# EAGLE schematic compressor_ngspice (EAGLE 9.6.2)
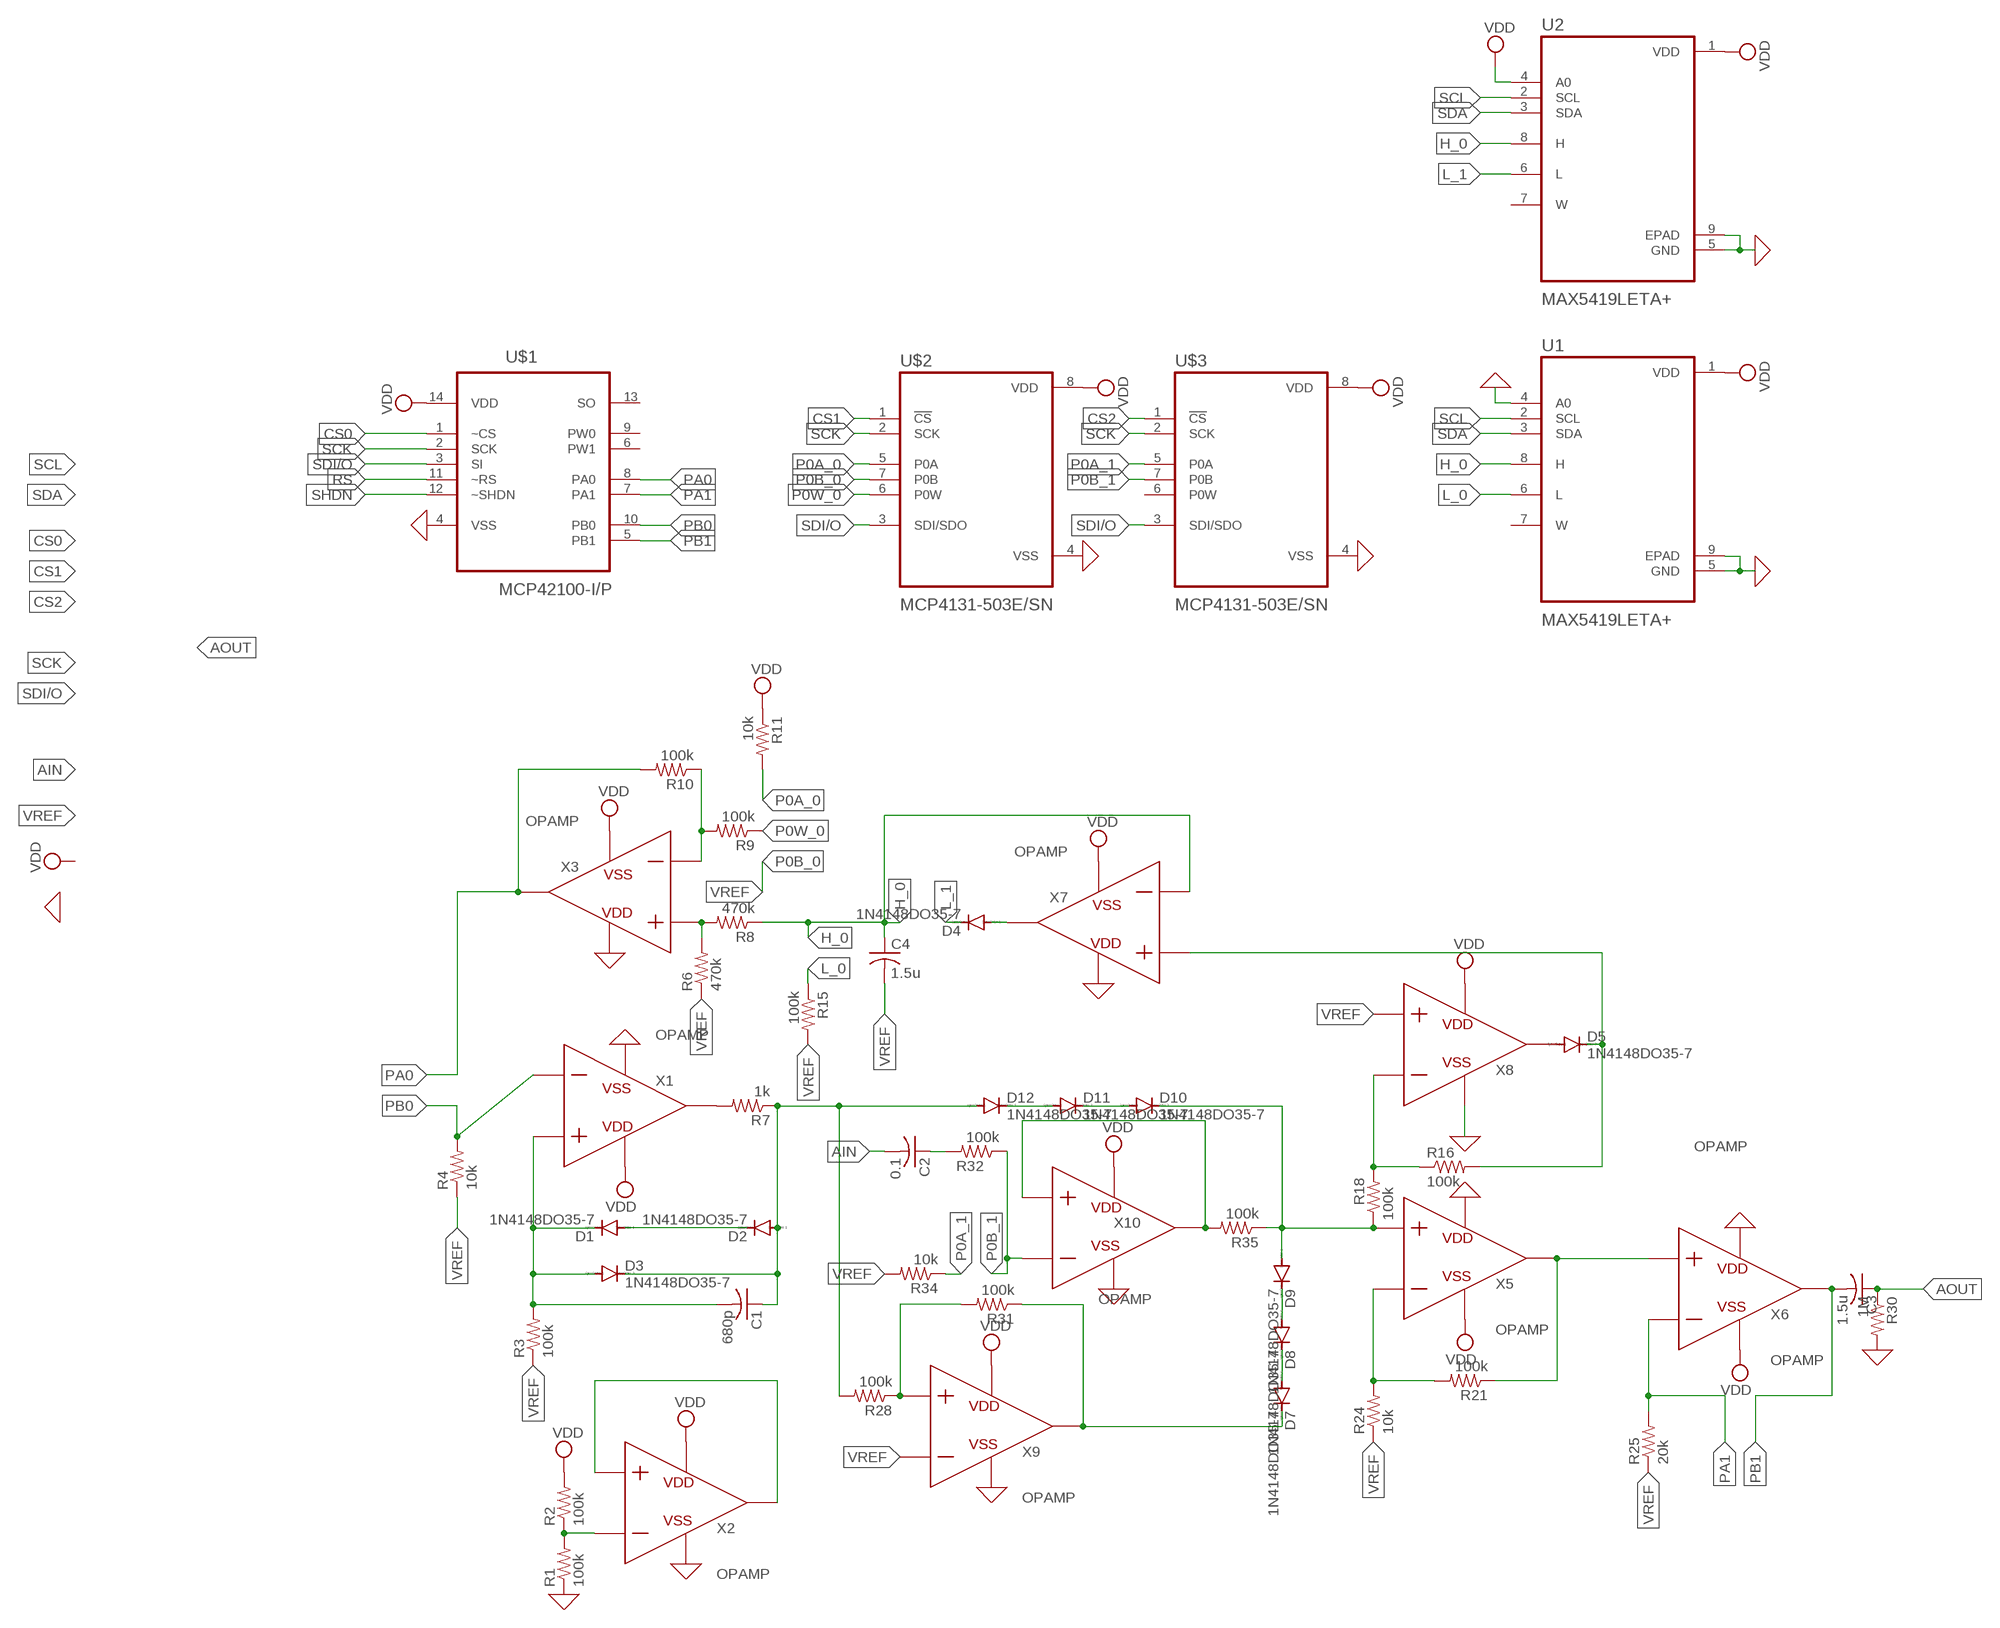
[diagram p0: schematic, sheet 1]

## Parts
C1  680p  C-US025-024X044  [C025-024X044]
C2  0.1  C-US025-024X044  [C025-024X044]
C3  1.5u  C-US025-024X044  [C025-024X044]
C4  1.5u  C-US025-024X044  [C025-024X044]
D1  1N4148DO35-7  [DO35-7]
D2  1N4148DO35-7  [DO35-7]
D3  1N4148DO35-7  [DO35-7]
D4  1N4148DO35-7  [DO35-7]
D5  1N4148DO35-7  [DO35-7]
D7  1N4148DO35-7  [DO35-7]
D8  1N4148DO35-7  [DO35-7]
D9  1N4148DO35-7  [DO35-7]
D10  1N4148DO35-7  [DO35-7]
D11  1N4148DO35-7  [DO35-7]
D12  1N4148DO35-7  [DO35-7]
R1  100k  R-US_0204/7  [0204/7]
R2  100k  R-US_0204/7  [0204/7]
R3  100k  R-US_0204/7  [0204/7]
R4  10k  R-US_0204/7  [0204/7]
R6  470k  R-US_0204/7  [0204/7]
R7  1k  R-US_0204/7  [0204/7]
R8  470k  R-US_0204/7  [0204/7]
R9  100k  R-US_0204/7  [0204/7]
R10  100k  R-US_0204/7  [0204/7]
R11  10k  R-US_0204/7  [0204/7]
R15  100k  R-US_0204/7  [0204/7]
R16  100k  R-US_0204/7  [0204/7]
R18  100k  R-US_0204/7  [0204/7]
R21  100k  R-US_0204/7  [0204/7]
R24  10k  R-US_0204/7  [0204/7]
R25  20k  R-US_0204/7  [0204/7]
R28  100k  R-US_0204/7  [0204/7]
R30  1M  R-US_0204/7  [0204/7]
R31  100k  R-US_0204/7  [0204/7]
R32  100k  R-US_0204/7  [0204/7]
R34  10k  R-US_0204/7  [0204/7]
R35  100k  R-US_0204/7  [0204/7]
U1  MAX5419LETA+  [SON65P300X300X80-9N]
U2  MAX5419LETA+  [SON65P300X300X80-9N]
U$1  MCP42100-I/P  [DIP254P762X432-14]
U$2  MCP4131-503E/SN  [SOIC127P599X175-8N]
U$3  MCP4131-503E/SN  [SOIC127P599X175-8N]
X1  OPAMP  (no package)
X2  OPAMP  (no package)
X3  OPAMP  (no package)
X5  OPAMP  (no package)
X6  OPAMP  (no package)
X7  OPAMP  (no package)
X8  OPAMP  (no package)
X9  OPAMP  (no package)
X10  OPAMP  (no package)

## Nets
0: R1.1 R30.2 U1.4(A0) U1.5(GND) U1.9(EPAD) U2.5(GND) U2.9(EPAD) U$1.4(VSS) U$2.4(VSS) U$3.4(VSS) X1.VSS X2.VSS X3.VDD X5.VDD X6.VDD X7.VDD X8.VSS X9.VSS X10.VSS ; supply symbol labelled GND
AIN: C2.2
AOUT: C3.1 R30.1
CS0: U$1.1(~CS)
CS1: U$2.1(!CS)
CS2: U$3.1(!CS)
H_0: C4.1 R8.1 U1.8(H) U2.8(H) X7.N
L_0: R15.1 U1.6(L)
L_1: D4.C U2.6(L)
N$1: R7.2 X1.VOUT
N$3: C1.2 D1.C D3.A R3.2 X1.P
N$4: R1.2 R2.1 X2.N
N$5: X2.P X2.VOUT
N$6: R6.2 R8.2 X3.P
N$7: R9.2 R10.1 X3.N
N$10: R11.2
N$11: C4.2
N$14: D4.A X7.VOUT
N$15: D5.C R16.2 X7.P
N$16: R16.1 R18.2 X8.N
N$18: R21.1 X5.VOUT X6.P
N$19: R21.2 R24.2 X5.N
N$20: D1.A D2.C
N$21: C1.1 D2.A D3.C D12.A R7.1 R28.2
N$22: R28.1 R31.2 X9.P
N$23: D7.C R31.1 X9.VOUT
N$24: D8.A D9.C
N$25: D7.A D8.C
N$26: D9.A D10.C R18.1 R35.1 X5.P
N$27: R35.2 X10.P X10.VOUT
N$30: C2.1 R32.2
N$31: D11.A D12.C
N$32: D10.A D11.C
N$33: D5.A X8.VOUT
P0A_0: U$2.5(P0A)
P0A_1: R34.1 U$3.5(P0A)
P0B_0: U$2.7(P0B)
P0B_1: R32.1 U$3.7(P0B) X10.N
P0W_0: U$2.6(P0W)
PA0: R10.2 U$1.8(PA0) X3.VOUT
PA1: R25.2 U$1.7(PA1) X6.N
PB0: R4.2 U$1.10(PB0) X1.N
PB1: C3.2 U$1.5(PB1) X6.VOUT
RS: U$1.11(~RS)
SCK: U$1.2(SCK) U$2.2(SCK) U$3.2(SCK)
SCL: U1.2(SCL) U2.2(SCL)
SDA: U1.3(SDA) U2.3(SDA)
SDI/O: U$1.3(SI) U$2.3(SDI/SDO) U$3.3(SDI/SDO)
SHDN: U$1.12(~SHDN)
VDD: R2.2 R11.1 U1.1(VDD) U2.1(VDD) U2.4(A0) U$1.14(VDD) U$2.8(VDD) U$3.8(VDD) X1.VDD X2.VDD X3.VSS X5.VSS X6.VSS X7.VSS X8.VDD X9.VDD X10.VDD
VREF: R4.1
Unconnected: R3.1 R6.1 R9.1 R15.2 R24.1 R25.1 R34.2 U1.7(W) U2.7(W) U$1.6(PW1) U$1.9(PW0) U$1.13(SO) U$3.6(P0W) X8.P X9.N

## Library data of the parts
C1-C4 = rcl:C-US: CAPACITOR, American symbol; SPICEPREFIX: C
D1-D5 D7-D12 = diode:1N4148: DIODE high speed (Philips)
R1-R4 R6-R11 R15 R16 R18 R21 R24 R25 R28 R30-R32 R34 R35 = rcl:R-US_: RESISTOR, American symbol; SPICEPREFIX: R
U1 U2 = MAX5419LETA_:MAX5419LETA+: Check availability <https://pricing.snapeda.com/parts/MAX5419LETA%2B/Analog%20Devices/view-part?ref=eda>; AVAILABILITY: In Stock; CHECK_PRICES: https://www.snapeda.com/parts/MAX5419LETA+/Analog+Devices/view-part/?ref=eda; DESCRIPTION: 256-Tap, Nonvolatile, I²C-Interface, Digital Potentiometers; MF: Analog Devices; MP: MAX5419LETA+; PACKAGE: TDFN-EP-8 Maxim; PRICE: None; PURCHASE-URL: https://www.snapeda.com/api/url_track_click_mouser/?unipart_id=895758&manufacturer=Analog Devices&part_name=MAX5419LETA+&search_term=max541; SNAPEDA_LINK: https://www.snapeda.com/parts/MAX5419LETA+/Analog+Devices/view-part/?ref=snap
U$1 = MCP42100-I_P:MCP42100-I/P: Digital Potentiometer Check availability <https://pricing.snapeda.com/parts/MCP42100-I/P/Microchip/view-part?ref=eda>; AVAILABILITY: In Stock; CHECK_PRICES: https://www.snapeda.com/parts/MCP42100-I/P/Microchip/view-part/?ref=eda; DESCRIPTION: Pot,Digital;Rest 100 Kilohms;Digital;256 Pos;14 Pins;2 Ch;Pkg DIP | Microchip Technology Inc. MCP42100-I/P; MF: Microchip; MP: MCP42100-I/P; PACKAGE: DIP-14 Microchip; PRICE: None; PURCHASE-URL: https://www.snapeda.com/api/url_track_click_mouser/?unipart_id=40874&manufacturer=Microchip&part_name=MCP42100-I/P&search_term=mcp42100; SNAPEDA_LINK: https://www.snapeda.com/parts/MCP42100-I/P/Microchip/view-part/?ref=snap
U$2 U$3 = MCP4131-503E_SN:MCP4131-503E/SN: Check availability <https://pricing.snapeda.com/parts/MCP4131-503E/SN/Microchip/view-part?ref=eda>; AVAILABILITY: In Stock; CHECK_PRICES: https://www.snapeda.com/parts/MCP4131-503E/SN/Microchip/view-part/?ref=eda; DESCRIPTION: MCP4131-503E/SN,Digi Potentiometer 50kOhm 129-Pos Linear Serial-SPI 8-Pin SOIC | Microchip Technology Inc. MCP4131-503E/SN; MF: Microchip; MP: MCP4131-503E/SN; PACKAGE: SOIC-8 Microchip; PRICE: None; PURCHASE-URL: https://www.snapeda.com/api/url_track_click_mouser/?unipart_id=129576&manufacturer=Microchip&part_name=MCP4131-503E/SN&search_term=mcp413; SNAPEDA_LINK: https://www.snapeda.com/parts/MCP4131-503E/SN/Microchip/view-part/?ref=snap
X1-X3 X5-X10 = ngspice-simulation:OPAMP: Operational amplifier with power pins